# Altium schematic sheet Power_Management.SchDoc: Power Management
size A4; Date: Not used; ApprovedBy: Not used; CheckedBy: Not used; Author: Not used; CompanyName: STMicroelectronics; DrawnBy: Not used; Engineer: Not used; Organization: Not used; Address1: Not used; Address2: Not used; Address3: Not used; Address4: Not used; DocumentNumber: Not used; Revision: Not used; SheetNumber: 5; SheetTotal: 6; CurrentTime: Not used; CurrentDate: Not used; Time: Not used; DocumentFullPathAndName: Not used; DocumentName: Not used; ModifiedDate: Not used; ImagePath: Not used; ProjectName: Not used; Application_BuildNumber: Not used
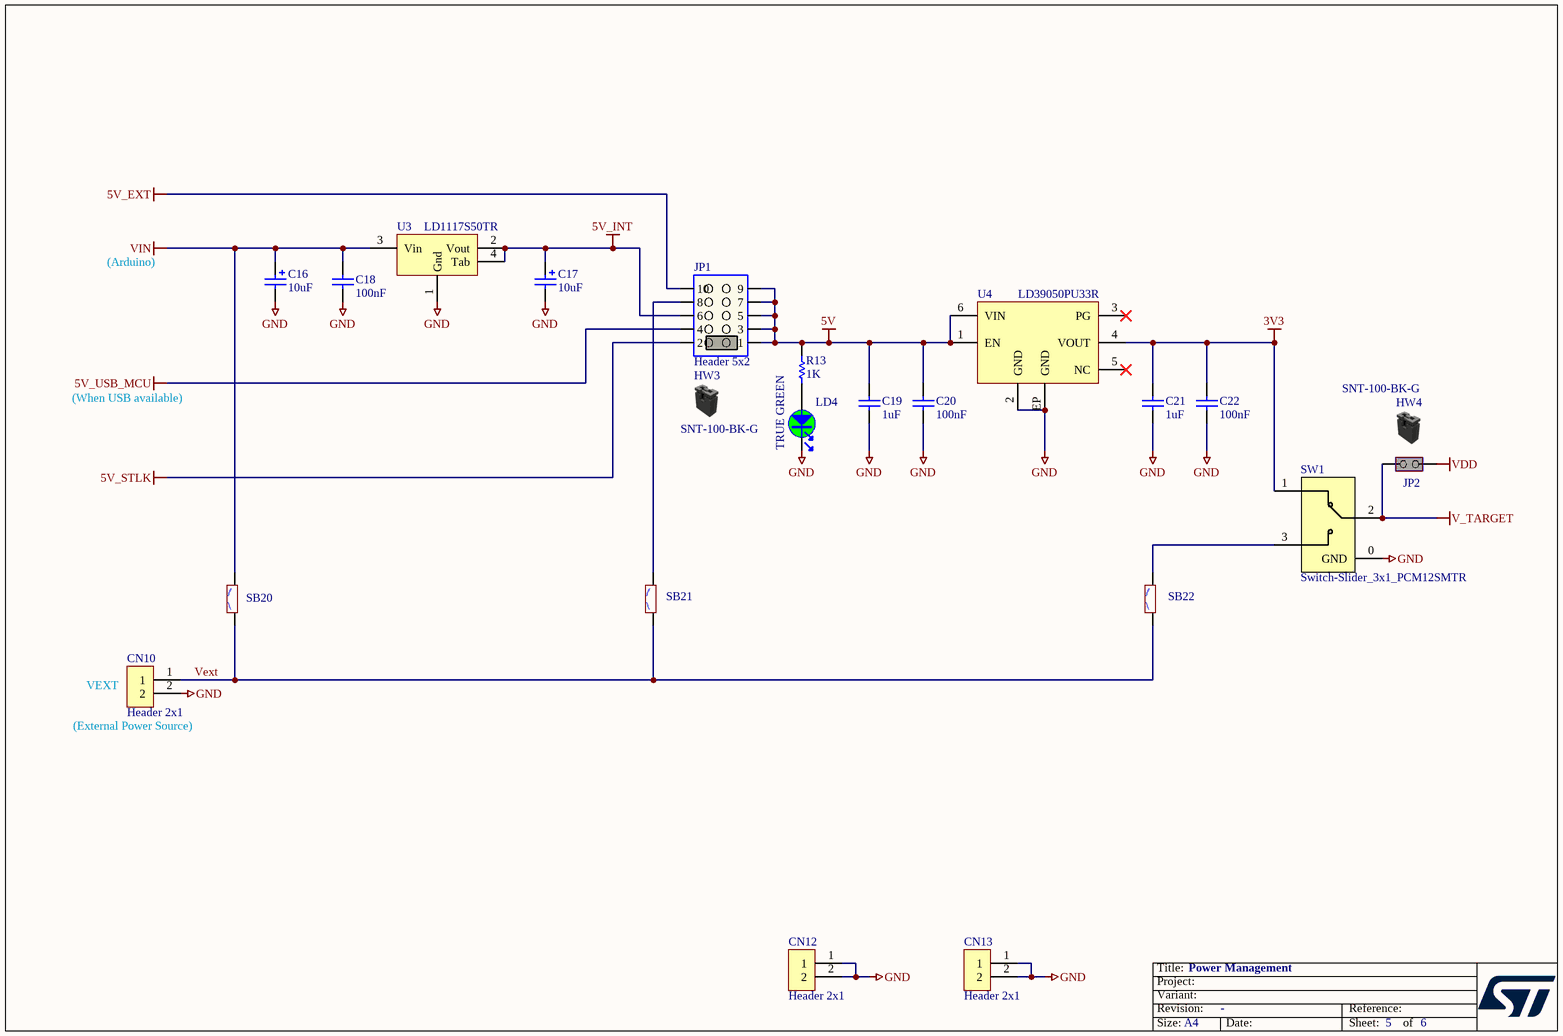
[diagram p0: Power_Management.SchDoc]

## Parts
C16  value 10uF  [CPOL_TAJ-B_1210_H210]  (hidden comment: Cap_POL_TANA)
C17  value 10uF  [CPOL_TAJ-B_1210_H210]  (hidden comment: Cap_POL_TANA)
C18  value 100nF  [C0402]  (hidden comment: Capacitor)
C19  value 1uF  [C0805_H0P85]  (hidden comment: Capacitor)
C20  value 100nF  [C0402]  (hidden comment: Capacitor)
C21  value 1uF  [C0805_H0P85]  (hidden comment: Capacitor)
C22  value 100nF  [C0402]  (hidden comment: Capacitor)
CN10  Header 2x1  [CON_SAMTEC_TSW-102-07-G-S]
CN12  Header 2x1  [CON_SAMTEC_TSW-102-07-G-S]
CN13  Header 2x1  [CON_SAMTEC_TSW-102-07-G-S]
HW3  value SNT-100-BK-G  (hidden comment: Shunt Black 2.54mm)  (mechanical)
HW4  value SNT-100-BK-G  (hidden comment: Shunt Black 2.54mm)  (mechanical)
JP1  value Header 5x2  [CON_SAMTEC_TSM-105-01-L-DV]  (hidden comment: Jumper_Header 5x2 Fitted 1-2)
JP2  Jumper_Header 2x1 Fitted  [CON_SAMTEC_TSW-102-07-G-S]  (value not drawn)
LD4  value TRUE GREEN  [LED_0603_VISHAY_VLMTG1300-GS08_GREEN_1A2K_H0P8]  (hidden comment: LED_green)
R13  value 1K  [R0402]  (hidden comment: Resistor)
SB20  SB_OFF  [SOLDER-BRIDGE_R0402-0R]  (value not drawn)
SB21  SB_OFF  [SOLDER-BRIDGE_R0402-0R]  (value not drawn)
SB22  SB_OFF  [SOLDER-BRIDGE_R0402-0R]  (value not drawn)
SW1  value Switch-Slider_3x1_PCM12SMTR  [SWI_SPDT-RA_TE-CONNECTIVITY_MLL1200S_1P2T]  (hidden comment: SW_MECA)
U3  LD1117S50TR  [REG_SOT223-TAB]
U4  LD39050PU33R  [ICC_DFN6-EPAD_3X3_P095]

## Nets
3V3: C21.2 C22.2 SW1.1 U4.4(VOUT)
5V: C19.2 C20.2 JP1.1 JP1.3 JP1.5 JP1.7 JP1.9 R13.2 U4.1(EN) U4.6(VIN)
5V_EXT: JP1.10
5V_INT: C17.1 JP1.6 U3.2(Vout) U3.4(Tab)
5V_STLK: JP1.2
5V_USB_MCU: JP1.4
GND: C16.2 C17.2 C18.1 C19.1 C20.1 C21.1 C22.1 CN10.2 CN12.1 CN12.2 CN13.1 CN13.2 LD4.2 SW1.0(GND) U3.1(Gnd) U4.2(GND) U4.EP(GND)
V_TARGET: JP2.1(COMMON) SW1.2
VDD: JP2.2(NO)
VIN: C16.1 C18.2 SB20.2 U3.3(Vin)
Vext: CN10.1 SB20.1 SB21.1 SB22.1
NetJP1_8: JP1.8 SB21.2
NetLD4_1: LD4.1 R13.1
NetSB22_2: SB22.2 SW1.3

Not connected (* = marked no-connect by the designer): U4 3(PG)* 5(NC)*

## Notes on the sheet
- (Arduino)
- (When USB available)
- (near CN10) VEXT
- (near CN10) (External Power Source)
- Title:
- Project:
- Size:
- Revision:
- Variant:
- A4
- -
- Date:
- Reference:
- Sheet:
- of

## Library data of the parts
C16 C17 = MCD-00324: Capacitor, Tantalum, 10uF, 25V, 2R5, +/-10%, Type_B (3528 metric), T=1.9mm; Manufacturer_Part_Number: TAJB106K025RNJ; Manufacturer: AVX; Part_Preference: Recommended; Order_Code_RS: 136-0159; Component_Country_Of_Origin: El Salvador; Revision: July-2002: Re-released for DXP Platform.; Internal_Part_Number: MCD-00324; Status: Released; Part_Type: Capacitor; Package: 3528 (metric); ComponentLink1URL: http://tunmcdsvn.tun.st.com/Component_Documentation_Library/Trunk/Capacitor/AVX_TAJ_Series; Order_Code_Digikey: 478-5257-1-ND; Order_Code_Farnell: 2333024
C18 C20 C22 = MCD-02355: Capacitor, MLCC, 100nF, 25V, X7R, +/-10%, 0402, T=0.5mm; Part_Preference: Recommended; Manufacturer: WALSIN; Manufacturer_Part_Number: 0402B104K250CT; Order_Code_RS: 176-3114; Component_Country_Of_Origin: Unknown; Internal_Part_Number: MCD-02355; Status: Checked; Part_Type: Capacitor; Package: 0402; ComponentLink1URL: http://tunmcdsvn.tun.st.com/Component_Documentation_Library/Trunk/Capacitor/WALSIN_Monolithic_Series/; Order_Code_Digikey: 1292-1175-1-ND; Order_Code_Farnell: 2496772
C19 C21 = MCD-01550: Capacitor, MLCC, 1uF, 16V, X5R, +/-10%, 0805, T=0.85mm; Manufacturer_Part_Number: CC0805KRX5R7BB105; Manufacturer: YAGEO; Part_Preference: Recommended; Component_Country_Of_Origin: China; Internal_Part_Number: MCD-01550; Status: Released; Part_Type: Capacitor; Package: 0805; ComponentLink1URL: http://tunmcdsvn.tun.st.com/Component_Documentation_Library/Trunk/Capacitor/YAGEO_X5R_Series; Order_Code_Digikey: 311-3427-1-ND; Order_Code_Farnell: N/A; Order_Code_RS: N/A
CN10 CN12 CN13 = MCD-00032: Header, 2x1, 2.54mm, VR, TH, T=5.84mm/2.54mm; Part_Type: Connector; Part_Preference: Recommended; Manufacturer: SAMTEC; Manufacturer_Part_Number: TSW-102-07-G-S; Order_Code_RS: 155-5312; Component_Country_Of_Origin: China, Costa Rica, Malaysia, United States, Vietnam; Internal_Part_Number: MCD-00032; Value: Header 2x1; Status: Released; ComponentLink1URL: http://tunmcdsvn.tun.st.com/Component_Documentation_Library/Trunk/Connector/SAMTEC_TSW_Series/; Order_Code_Digikey: SAM1029-02-ND; Order_Code_Farnell: 2505044
HW3 HW4 = MCD-00043: SHUNT 2.54mm BLACK; Part_Type: Misc; Manufacturer: SAMTEC; Part_Preference: Recommended; Alternate_Internal_Part_Number: MCD-02388; Component_Country_Of_Origin: China, Costa Rica, Malaysia, United States, Vietnam; Internal_Part_Number: MCD-00043; Status: Released; Manufacturer_Part_Number: SNT-100-BK-G; ComponentLink1URL: http://tunmcdsvn.tun.st.com/Component_Datasheet_Library/Trunk/Connectors/Samtec_Shunt_Jumper_SNT100
JP1 = MCD-01230: Header, 5x2, 2.54mm, VR, SMD, T=5.84mm; BMS_Part_Number: 9183642; Part_Type: Connector; Part_Preference: Recommended; Manufacturer: SAMTEC; Manufacturer_Part_Number: TSM-105-01-L-DV; Order_Code_RS: 765-6506; Component_Country_Of_Origin: China, Costa Rica, Malaysia, United States, Vietnam; Internal_Part_Number: MCD-01230; Status: Checked; ComponentLink1URL: http://tunmcdsvn.tun.st.com/Component_Documentation_Library/Trunk/Connector/SAMTEC_TSM_Series/; Order_Code_Digikey: SAM8984-ND; Order_Code_Farnell: 1885917
JP2 = MCD-01904: Header, 2x1, 2.54mm, VR, TH, T=5.84mm/2.54mm; Part_Type: Connector; Manufacturer_Part_Number: TSW-102-07-G-S; Manufacturer: SAMTEC; Part_Preference: Recommended; Order_Code_RS: 155-7981; Component_Country_Of_Origin: China, Costa Rica, Malaysia, United States, Vietnam; Internal_Part_Number: MCD-01904; Value: Header 2x1; Status: Checked; ComponentLink1URL: http://tunmcdsvn.tun.st.com/Component_Documentation_Library/Trunk/Connector/SAMTEC_TSW_Series/; Order_Code_Digikey: SAM1029-02-ND; Order_Code_Farnell: 2505044
LD4 = MCD-00589: LED Green, 0603 SMD, Fw Voltage = 2.8V - 3.6V; Part_Type: Display; Manufacturer_Part_Number: VLMTG1300-GS08; Manufacturer: VISHAY; Part_Preference: Recommended; Order_Code_RS: 7730452; Component_Country_Of_Origin: China; Internal_Part_Number: MCD-00589; Status: Released; Package: LED 0603; ComponentLink1URL: http://tunmcdsvn.tun.st.com/Component_Datasheet_Library/Trunk/Display/VISHAY_LED_GREEN_VLMTG1300-GS08; Order_Code_Digikey: VLMTG1300-GS08CT-ND; Order_Code_Farnell: 2251490
R13 = MCD-00061: Resistor, 1K, 0402, +/-1%,1/16W; Manufacturer_Part_Number: RC0402FR-071KL; Manufacturer: YAGEO; Part_Preference: Recommended; Component_Country_Of_Origin: China; Internal_Part_Number: MCD-00061; Status: Released; Part_Type: Resistor; Package: 0402; ComponentLink1URL: http://tunmcdsvn.tun.st.com/Component_Documentation_Library/Trunk/Resistor/YAGEO_RC_L_Series; Order_Code_Digikey: 311-1.00KLRCT-ND; Order_Code_Farnell: 9239235; Order_Code_RS: N/A
SB20-SB22 = MCD-02162: Solder Bridge 0402 OFF; Part_Type: Misc; Part_Preference: Recommended; Manufacturer: YAGEO; Manufacturer_Part_Number: RC0402JR-070RL; Order_Code_RS: 618-5804; Component_Country_Of_Origin: China; Value: SB0402; Internal_Part_Number: MCD-02162; Status: Checked; Package: SB0402; ComponentLink1URL: http://tunmcdsvn.tun.st.com/Component_Datasheet_Library/Trunk/Resistors/Yageo_Resistor_RC0402-series; Order_Code_Digikey: 311-0.0JRTR-ND; Order_Code_Farnell: 2363467
SW1 = MCD-03571: Slide switch, 3x1, 1.5mm, RA, SMT, T=1.65mm; Part_Type: Connector; Part_Preference: Recommended; Manufacturer: C&K; Manufacturer_Part_Number: PCM12SMTR; Order_Code_RS: 793-1721; ShowFields: YES; ID: 5687; Internal_Part_Number: MCD-03571; Status: New; Package: NA; ComponentLink1URL: http://tunmcdsvn.tun.st.com/Component_Documentation_Library/Trunk/Connector/C&K_PCM12SMTR/; Order_Code_Digikey: 401-2016-2-ND; Order_Code_Farnell: 9575146
U3 = MCD-00088: IC REG LDO 5V 0.8A SOT223; Manufacturer: STMICROELECTRONICS; BMS_Part_Number: 9176133; Part_Preference: Recommended; Manufacturer_HQ_COO: EU; Component_Country_Of_Origin: China; Internal_Part_Number: MCD-00088; Value: LD1117S50TR; Status: Released; Part_Type: IC; Manufacturer_Part_Number: LD1117S50TR; Package: SOT-223; ComponentLink1URL: http://tunmcdsvn.tun.st.com/Component_Datasheet_Library/Trunk/IC/STM_LDO_LD1117
U4 = MCD-00215: Low quiescent current and low noise voltage regulators; Part_Type: IC; Manufacturer: STMICROELECTRONICS; BMS_Part_Number: 9176126; Part_Preference: Recommended; Manufacturer_HQ_COO: EU; Component_Country_Of_Origin: Malaysia; Internal_Part_Number: MCD-00215; Value: LD39050PU33R; Status: Released; Manufacturer_Part_Number: LD39050PU33R; Package: DFN6 3x3mm; ComponentLink1URL: http://tunmcdsvn.tun.st.com/Component_Datasheet_Library/Trunk/IC/STM_LDO_LD39050PU